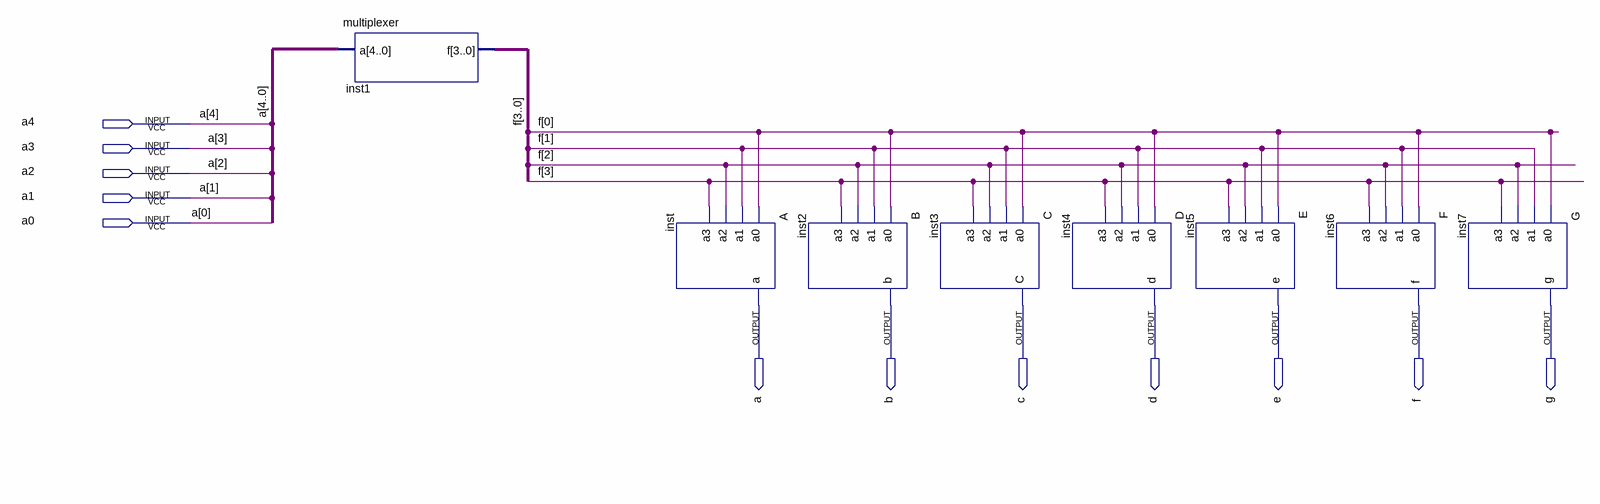
[diagram p0: schematic sheet]
// Quartus schematic outsidedisplay.bdf as structural Verilog: 8 symbols, 12 pins
module outsidedisplay (
  input  a4,
  input  a3,
  input  a2,
  input  a1,
  input  a0,
  output a,
  output b,
  output c,
  output d,
  output e,
  output f,
  output g
);

  wire [3:0] f_bus;

  multiplexer inst1 (.a({a4, a3, a2, a1, a0}), .f(f_bus));
  A inst (.a0(f_bus[0]), .a1(f_bus[1]), .a2(f_bus[2]), .a3(f_bus[3]), .a(a));
  B inst2 (.a0(f_bus[0]), .a1(f_bus[1]), .a2(f_bus[2]), .a3(f_bus[3]), .b(b));
  C inst3 (.a0(f_bus[0]), .a1(f_bus[1]), .a2(f_bus[2]), .a3(f_bus[3]), .C(c));
  D inst4 (.a3(f_bus[3]), .a2(f_bus[2]), .a1(f_bus[1]), .a0(f_bus[0]), .d(d));
  E inst5 (.a0(f_bus[0]), .a1(f_bus[1]), .a2(f_bus[2]), .a3(f_bus[3]), .e(e));
  F inst6 (.a0(f_bus[0]), .a1(f_bus[1]), .a2(f_bus[2]), .a3(f_bus[3]), .f(f));
  G inst7 (.a3(f_bus[3]), .a2(f_bus[2]), .a1(f_bus[1]), .a0(f_bus[0]), .g(g));
endmodule
